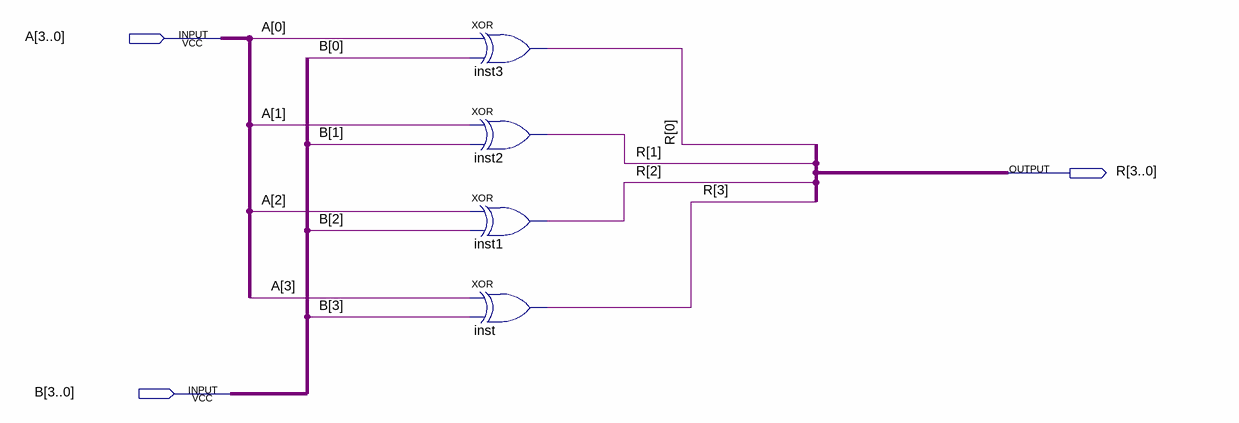
[diagram p0: schematic sheet]
// Quartus schematic XOR4Bits.bdf as structural Verilog: 4 symbols, 3 pins
module XOR4Bits (
  input  [3:0] A,
  input  [3:0] B,
  output [3:0] R
);

  xor inst3 (R[0], A[0], B[0]);
  xor inst2 (R[1], A[1], B[1]);
  xor inst1 (R[2], A[2], B[2]);
  xor inst (R[3], A[3], B[3]);
endmodule
